# Altium schematic sheet DAC.SchDoc
size A; SheetNumber: 4; SheetTotal: 5
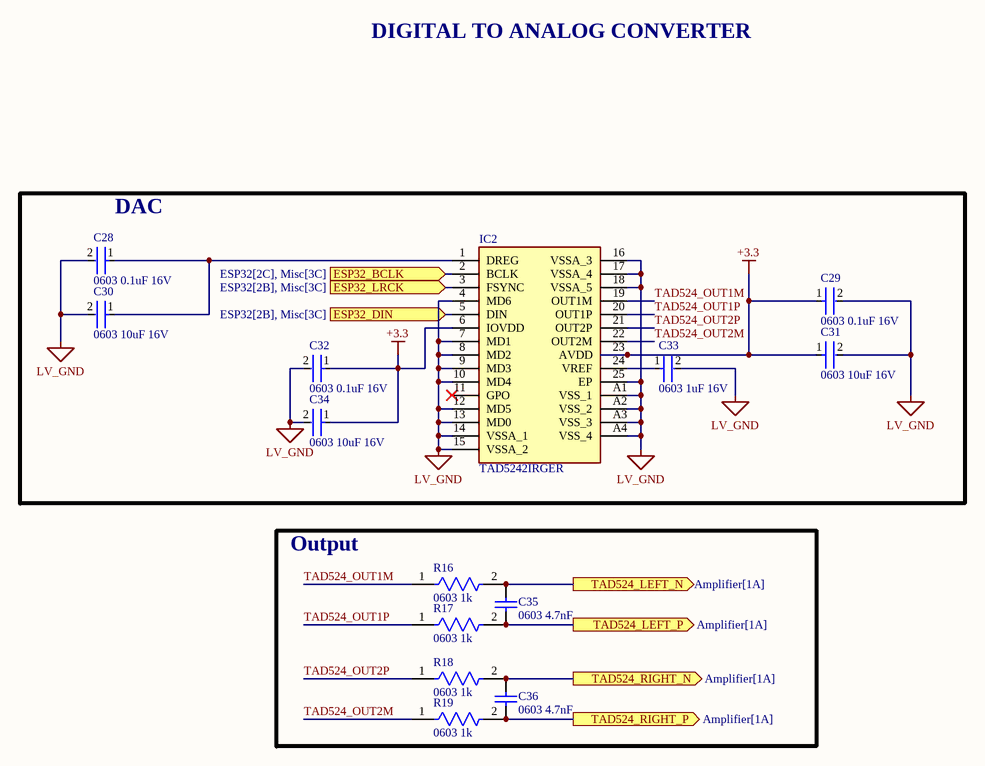
[diagram p0: DAC.SchDoc]

## Parts
C28  0603 0.1uF 16V  [FP-CC0603-DA-MFG]
C29  0603 0.1uF 16V  [FP-CC0603-DA-MFG]
C30  0603 10uF 16V  [FP-0603-L_1_6_0_2-W_0_8_0-MFG]
C31  0603 10uF 16V  [FP-0603-L_1_6_0_2-W_0_8_0-MFG]
C32  0603 0.1uF 16V  [FP-CC0603-DA-MFG]
C33  0603 1uF 16V  [FP-CC0603-DA-MFG]
C34  0603 10uF 16V  [FP-0603-L_1_6_0_2-W_0_8_0-MFG]
C35  0603 4.7nF  [CAPC1608X90X35ML10T15]
C36  0603 4.7nF  [CAPC1608X90X35ML10T15]
IC2  TAD5242IRGER  [TAD5242IRGER]
R16  0603 1k  [FP-AC0603-IPC_B]
R17  0603 1k  [FP-AC0603-IPC_B]
R18  0603 1k  [FP-AC0603-IPC_B]
R19  0603 1k  [FP-AC0603-IPC_B]

## Blocks framed on the sheet
DAC: C28-C34 IC2
Output: C35 C36 R16-R19

## Ports
ESP32_BCLK (in, see ESP32[2C], Misc[3C]), ESP32_DIN (in, see ESP32[2B], Misc[3C]), ESP32_LRCK (in, see ESP32[2B], Misc[3C]), TAD524_LEFT_N (out, see Amplifier[1A]), TAD524_LEFT_P (out, see Amplifier[1A]), TAD524_RIGHT_N (out, see Amplifier[1A]), TAD524_RIGHT_P (out, see Amplifier[1A])

## Nets
+3.3: C29.1 C31.1 C32.1 C34.1 IC2.6(IOVDD) IC2.23(AVDD)
LV_GND: C28.2 C29.2 C30.2 C31.2 C32.2 C33.2 C34.2 IC2.4(MD6) IC2.7(MD1) IC2.8(MD2) IC2.9(MD3) IC2.10(MD4) IC2.12(MD5) IC2.13(MD0) IC2.14(VSSA_1) IC2.15(VSSA_2) IC2.16(VSSA_3) IC2.17(VSSA_4) IC2.18(VSSA_5) IC2.25(EP) IC2.A1(VSS_1) IC2.A2(VSS_2) IC2.A3(VSS_3) IC2.A4(VSS_4)
ESP32_BCLK: IC2.2(BCLK) ; port ESP32_BCLK
ESP32_DIN: IC2.5(DIN) ; port ESP32_DIN
ESP32_LRCK: IC2.3(FSYNC) ; port ESP32_LRCK
TAD524_LEFT_N: C35.1 R16.2 ; port TAD524_LEFT_N
TAD524_LEFT_P: C35.2 R17.2 ; port TAD524_LEFT_P
TAD524_OUT1M: IC2.19(OUT1M) R16.1
TAD524_OUT1P: IC2.20(OUT1P) R17.1
TAD524_OUT2M: IC2.22(OUT2M) R19.1
TAD524_OUT2P: IC2.21(OUT2P) R18.1
TAD524_RIGHT_N: C36.1 R18.2 ; port TAD524_RIGHT_N
TAD524_RIGHT_P: C36.2 R19.2 ; port TAD524_RIGHT_P
NetC28_1: C28.1 C30.1 IC2.1(DREG)
NetC33_1: C33.1 IC2.24(VREF)

Not connected (* = marked no-connect by the designer): IC2 11(GPO)*

## Notes on the sheet
- DIGITAL TO ANALOG CONVERTER

## Library data of the parts
C28 C29 C32 = CMP-2000-05002-2: CAP CER 0.1UF 16V X7R 0603; Manufacturer Part Number: CC0603KRX7R7BB104; Manufacturer: YAGEO; Tolerance: 0.1; Value: 100 nF; Temperature Coefficient: 15%; Material: Ceramic; Voltage Rating: 16 V; Package: CC0603-DA; ComponentLink2Description: Datasheet; Octopart: https://octopart.com/cc0603krx7r7bb104-yageo-192941; Temperature Range High: +125°C; Digikey Description: CAP CER 0.1UF 16V X7R 0603; Voltage: 16 V; Device Class L2: Capacitors; Height: 0.9mm; Temperature: -55°C to +125°C; Device Class L1: Passive Components; Device Class L3: Ceramic Capacitors; ComponentLink2URL: http://www.yageo.com/documents/recent/UPY-GPHC_X7R_6.3V-to-50V_18.pdf; Footprint Url: http://www.yageo.com/exep/pages/download/literatures/UPY-C_GEN_24.pdf; RoHS: TRUE; Temperature Range Low: -55°C; Temperature Characteristic: X7R; Lead Free: Yes; Capacitance: 100 nF; Category: Cap; Mouser Description: Multilayer Ceramic Capacitor, CC Series, 0.1 - F, - 10%, X7R, 16 V, 0603 [1608 Metric]; Automotive: No
C30 C31 C34 = CMP-2000-06226-4: Multilayer Ceramic Capacitor 10uF 16V X5R 20% SMD 0603 T/R; Packaging: Tape and Reel; Construction: Flat; Height: 0.8mm; Max Operating Temperature: 85°C; Dielectric: X5R; Case Code (Metric): 1608; Voltage Rating (DC): 16V; Width: 0.031inch; Voltage Rating: 16V; Length: 0.063inch; RoHS Compliant: Yes; Halogen Free: Halogen Free; Case Code (Imperial): 0603; Capacitance: 10uF; Mount: Surface Mount; Thickness: 0.031inch; Tolerance: 20%; Min Operating Temperature: -55°C; Series: M; Termination: SMD/SMT; Case/Package: 0603; Package Quantity: 1
C33 = CMP-03422-000924-1: CAP CER 1UF 16V X7R 0603; Manufacturer: YAGEO; Manufacturer Part Number: CC0603KRX7R7BB105; Tolerance: 0.1; Temperature Coefficient: 15%; Material: Ceramic; Package: CC0603-DA; RoHS: TRUE; Device Class L2: Capacitors; Temperature Characteristic: X7R; Temperature: -55°C to +125°C; Temperature Range Low: -55°C; Automotive: No; ComponentLink2Description: Datasheet; Value: 1 uF; Lead Free: Yes; Capacitance: 1 uF; ComponentLink2URL: http://www.yageo.com/documents/recent/UPY-GPHC_X7R_6.3V-to-50V_18.pdf; Device Class L1: Passive Components; Voltage: 16 V; Octopart: https://octopart.com/cc0603krx7r7bb105-yageo-42271928; Category: Cap; Digikey Description: CAP CER 1UF 16V X7R 0603; Footprint Url: http://www.yageo.com/exep/pages/download/literatures/UPY-C_GEN_24.pdf; Height: 0.9mm; Voltage Rating: 16 V; Temperature Range High: +125°C; Mouser Description: Multilayer Ceramic Capacitor, CC Series, 1 - F, - 10%, X7R, 16 V, 0603 [1608 Metric]; Device Class L3: Ceramic Capacitors
C35 C36 = CMP-2006-02924-1: Part Number: GRM188R71H472KA01D; Manufacturer: Murata
IC2 = TAD5242IRGER: Integrated Circuit; Manufacturer_Name: Texas Instruments; Datasheet Link: https://www.ti.com/lit/ds/symlink/tad5242.pdf?ts=1736249226355&ref_url=https%253A%252F%252Fwww.ti.com%252Fproduct%252FTAD5242; Height: 1mm; Manufacturer_Part_Number: TAD5242IRGER; Mouser Part Number: 595-TAD5242IRGER; Mouser Price/Stock: https://www.mouser.co.uk/ProductDetail/Texas-Instruments/TAD5242IRGER?qs=%252BXxaIXUDbq07iiss%252B1zA7A%3D%3D
R16-R19 = CMP-2000-04828-3: RES 1kΩ 1.00% 0.1W 0603; Voltage Rating: 50V; Power Rating: 100mW; Tolerance: 1%; Temperature Coefficient: 100ppm/°C; Resistance: 1kR; Depth: 0.8mm; Case/Package: 0603; Size Code: 0603; Case Code (Metric): 1608; Height: 0.022inch; Series: AC; Width: 0.031inch; Construction: Rectangular; Length: 0.063inch; Case Code (Imperial): 0603; Package Quantity: 1; RoHS Compliant: Yes; Features: Moisture Resistant; Resistor Type: Thick Film; Max Power Dissipation: 100mW; Packaging: Tape and Reel; Termination: SMD/SMT; Ratings: AEC-Q200; Max Operating Temperature: 155°C; Min Operating Temperature: -55°C; Military Standard: Not; Lead Free: Lead Free; Number of Terminations: 2